# EAGLE schematic ECG_BTLE (EAGLE 6.4)
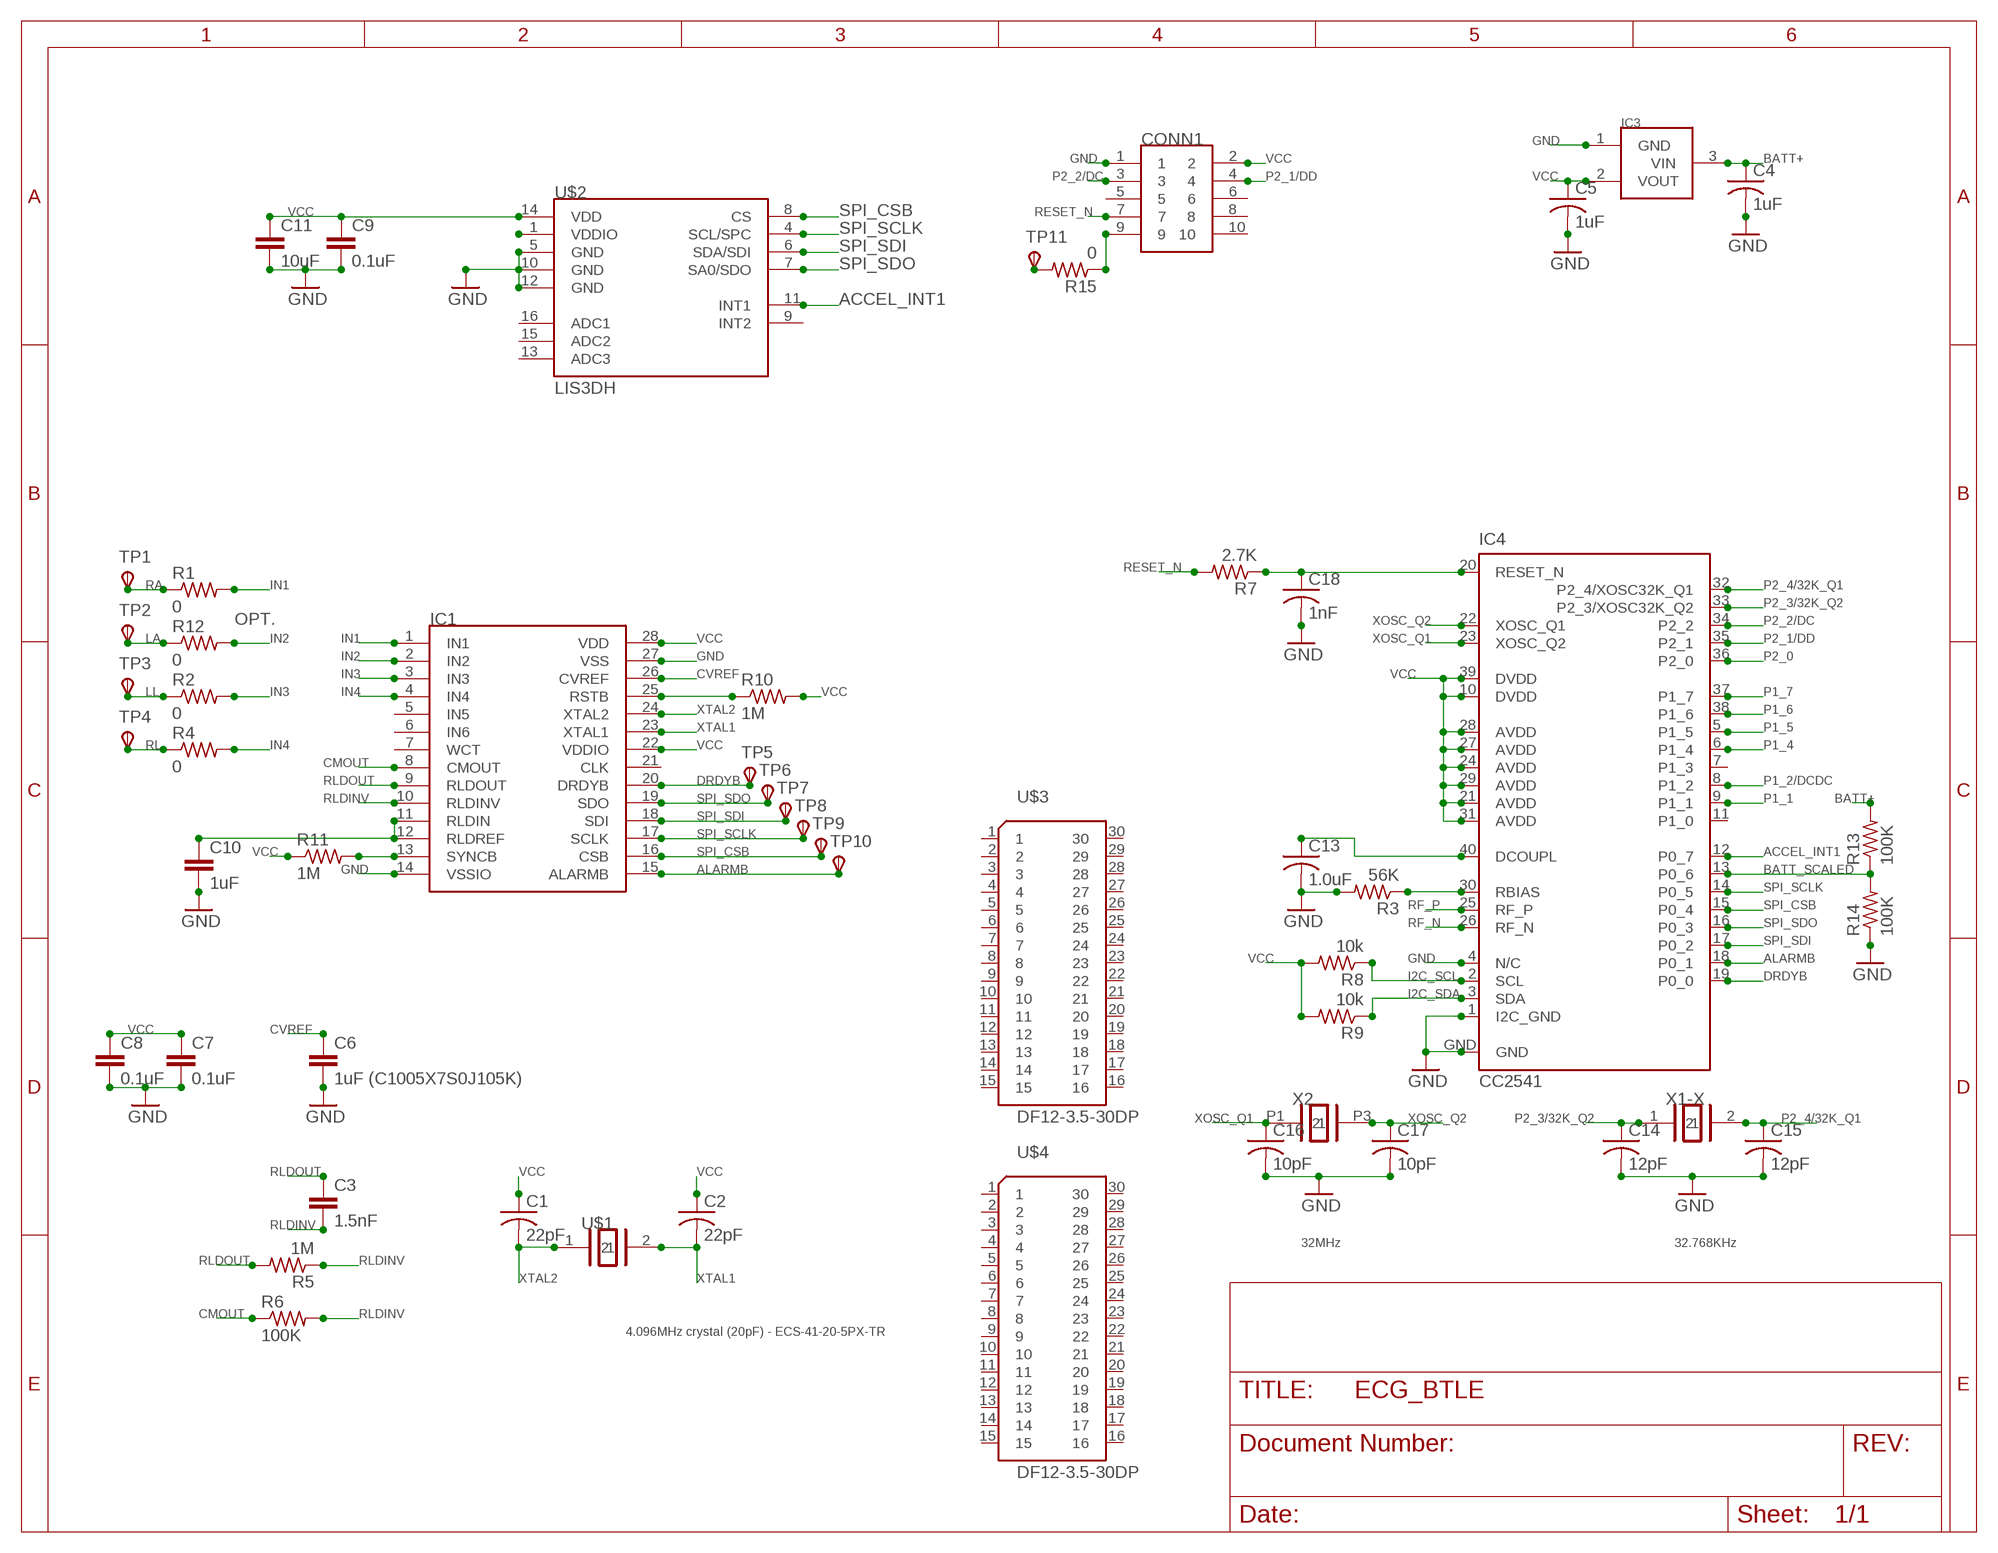
[diagram p0: schematic, sheet 1]

## Parts
C1  22pF  C-USC0201  [C0201]
C2  22pF  C-USC0201  [C0201]
C3  1.5nF  C-EUC0402  [C0402]
C4  1uF  C-USC0201  [C0201]
C5  1uF  C-USC0201  [C0201]
C6  1uF (C1005X7S0J105K)  C-EUC0402  [C0402]
C7  0.1uF  C-EUC0402  [C0402]
C8  0.1uF  C-EUC0402  [C0402]
C9  0.1uF  C-EUC0402  [C0402]
C10  1uF  C-EUC0402  [C0402]
C11  10uF  C-EUC0402  [C0402]
C13  1.0uF  C-USC0402  [C0402]
C14  12pF  C-USC0201  [C0201]
C15  12pF  C-USC0201  [C0201]
C16  10pF  C-USC0201  [C0201]
C17  10pF  C-USC0201  [C0201]
C18  1nF  C-USC0402  [C0402]
CONN1  10POS_1.27MM_SMD  [1.27MM_SMD]
IC1  ADS1293  [WQFN28]
IC3  MCP1703  [SOT23]
IC4  CC2541  [RHA_S-PVQFN-N40]
R1  0  R-US_R0402  [R0402]
R2  0  R-US_R0402  [R0402]
R3  56K  R-US_R0201  [R0201]
R4  0  R-US_R0402  [R0402]
R5  1M  R-US_R0603  [R0603]
R6  100K  R-US_R0402  [R0402]
R7  2.7K  R-US_R0201  [R0201]
R8  10k  R-US_R0201  [R0201]
R9  10k  R-US_R0201  [R0201]
R10  1M  R-US_R0402  [R0402]
R11  1M  R-US_R0402  [R0402]
R12  0  R-US_R0402  [R0402]
R13  100K  R-US_R0201  [R0201]
R14  100K  R-US_R0201  [R0201]
R15  0  R-US_R0201  [R0201]
TP1  TPSTP08SQ  [TP08SQ]
TP2  TPSTP08SQ  [TP08SQ]
TP3  TPSTP08SQ  [TP08SQ]
TP4  TPSTP08SQ  [TP08SQ]
TP5  TPSTP08SQ  [TP08SQ]
TP6  TPSTP08SQ  [TP08SQ]
TP7  TPSTP08SQ  [TP08SQ]
TP8  TPSTP08SQ  [TP08SQ]
TP9  TPSTP08SQ  [TP08SQ]
TP10  TPSTP08SQ  [TP08SQ]
TP11  TPSTP08SQ  [TP08SQ]
U$1  XTAL-CSM7  [CSM-7]
U$2  LIS3DH  [LGA16-3MM]
U$3  DF12-3.5-30DP  [DF12-3.5-30DP]
U$4  DF12-3.5-30DP  [DF12-3.5-30DP]
X1-X  XTAL-2SMD  [2-SMD]
X2  XTAL_403  [4-SMD]

## Nets
ACCEL_INT1: IC4.12(P0_7) U$2.11(INT1)
ALARMB: IC1.15(ALARMB) IC4.18(P0_1) TP10.TP(PP)
BATT+: C4.1 IC3.3(VIN) R13.2
BATT_SCALED: IC4.13(P0_6) R13.1 R14.2
CMOUT: IC1.8(CMOUT) R6.1
CVREF: C6.1 IC1.26(CVREF)
DCOUPL1: C13.1 IC4.40(DCOUPL)
DRDYB: IC1.20(DRDYB) IC4.19(P0_0) TP5.TP(PP)
GND: C4.2 C5.2 C6.2 C7.2 C8.2 C9.2 C10.2 C11.2 C13.2 C14.2 C15.2 C16.2 C17.2 C18.2 CONN1.1 IC1.14(VSSIO) IC1.27(VSS) IC3.1(GND) IC4.1(I2C_GND) IC4.4(N/C) IC4.GND R3.2 R14.1 U$2.5(GND) U$2.10(GND) U$2.12(GND)
I2C_SCL: IC4.2(SCL) R8.1
I2C_SDA: IC4.3(SDA) R9.1
IN1: IC1.1(IN1) R1.2
IN2: IC1.2(IN2) R12.2
IN3: IC1.3(IN3) R2.2
IN4: IC1.4(IN4) R4.2
LA: R12.1 TP2.TP(PP)
LL: R2.1 TP3.TP(PP)
N$1: CONN1.9 R15.1
N$2: R15.2 TP11.TP(PP)
N$5: IC1.25(RSTB) R10.1
N$8: C18.1 IC4.20(RESET_N) R7.1
N$11: C10.1 IC1.11(RLDIN) IC1.12(RLDREF)
N$12: IC1.13(SYNCB) R11.2
N$13: U$2.1(VDDIO)
P1_1: IC4.9(P1_1)
P1_2/DCDC: IC4.8(P1_2)
P1_4: IC4.6(P1_4)
P1_5: IC4.5(P1_5)
P1_6: IC4.38(P1_6)
P1_7: IC4.37(P1_7)
P2_0: IC4.36(P2_0)
P2_1/DD: CONN1.4 IC4.35(P2_1)
P2_2/DC: CONN1.3 IC4.34(P2_2)
P2_3/32K_Q2: C14.1 IC4.33(P2_3/XOSC32K_Q2) X1-X.1
P2_4/32K_Q1: C15.1 IC4.32(P2_4/XOSC32K_Q1) X1-X.2
R_BIAS: IC4.30(RBIAS) R3.1
RA: R1.1 TP1.TP(PP)
RESET_N: CONN1.7 R7.2
RF_N: IC4.26(RF_N)
RF_P: IC4.25(RF_P)
RL: R4.1 TP4.TP(PP)
RLDINV: C3.2 IC1.10(RLDINV) R5.1 R6.2
RLDOUT: C3.1 IC1.9(RLDOUT) R5.2
SPI_CSB: IC1.16(CSB) IC4.15(P0_4) TP9.TP(PP) U$2.8(CS)
SPI_SCLK: IC1.17(SCLK) IC4.14(P0_5) TP8.TP(PP) U$2.4(SCL/SPC)
SPI_SDI: IC1.18(SDI) IC4.17(P0_2) TP7.TP(PP) U$2.6(SDA/SDI)
SPI_SDO: IC1.19(SDO) IC4.16(P0_3) TP6.TP(PP) U$2.7(SA0/SDO)
VCC: C1.1 C2.1 C5.1 C7.1 C8.1 C9.1 C11.1 CONN1.2 IC1.22(VDDIO) IC1.28(VDD) IC3.2(VOUT) IC4.10(DVDD) IC4.21(AVDD) IC4.24(AVDD) IC4.27(AVDD) IC4.28(AVDD) IC4.29(AVDD) IC4.31(AVDD) IC4.39(DVDD) R8.2 R9.2 R10.2 R11.1 U$2.14(VDD)
XOSC_Q1: C16.1 IC4.23(XOSC_Q2) X2.P1
XOSC_Q2: C17.1 IC4.22(XOSC_Q1) X2.P3
XTAL1: C2.2 IC1.23(XTAL1) U$1.2
XTAL2: C1.2 IC1.24(XTAL2) U$1.1
Unconnected: CONN1.5 CONN1.6 CONN1.8 CONN1.10 IC1.5(IN5) IC1.6(IN6) IC1.7(WCT) IC1.21(CLK) IC4.7(P1_3) IC4.11(P1_0) U$2.9(INT2) U$2.13(ADC3) U$2.15(ADC2) U$2.16(ADC1) U$3.1 U$3.2 U$3.3 U$3.4 U$3.5 U$3.6 U$3.7 U$3.8 U$3.9 U$3.10 U$3.11 U$3.12 U$3.13 U$3.14 U$3.15 U$3.16 U$3.17 U$3.18 U$3.19 U$3.20 U$3.21 U$3.22 U$3.23 U$3.24 U$3.25 U$3.26 U$3.27 U$3.28 U$3.29 U$3.30 U$4.1 U$4.2 U$4.3 U$4.4 U$4.5 U$4.6 U$4.7 U$4.8 U$4.9 U$4.10 U$4.11 U$4.12 U$4.13 U$4.14 U$4.15 U$4.16 U$4.17 U$4.18 U$4.19 U$4.20 U$4.21 U$4.22 U$4.23 U$4.24 U$4.25 U$4.26 U$4.27 U$4.28 U$4.29 U$4.30

## Notes on the sheet
- OPT.
- 32MHz | 32.768KHz
- 4.096MHz crystal (20pF) - ECS-41-20-5PX-TR

## Library data of the parts
C1 C2 C4 C5 C13-C18 = rcl:C-US: CAPACITOR, American symbol
C3 C6-C11 = rcl:C-EU: CAPACITOR, European symbol
CONN1 = harwin:10POS_1.27MM_SMD
IC1 = texas_instruments:ADS1293
IC3 = microchip_regulators:MCP1703
IC4 = ST-CC254X:CC2541: CC2541 Bluetooth Smart SoC
R1 R2 R4-R6 R10-R12 = resistor:R-US_: RESISTOR, American symbol
R3 R7-R9 R13-R15 = rcl:R-US_: RESISTOR, American symbol
TP1-TP11 = testpad:TPS: TEST PIN
U$1 = ecs:XTAL-CSM7
U$2 = st:LIS3DH
U$3 U$4 = hirose:DF12-3.5-30DP: 30 pin connector PN: DF12(3.5)-30DP-0.5V
X1-X = ecs:XTAL-2SMD
X2 = cts:XTAL_403